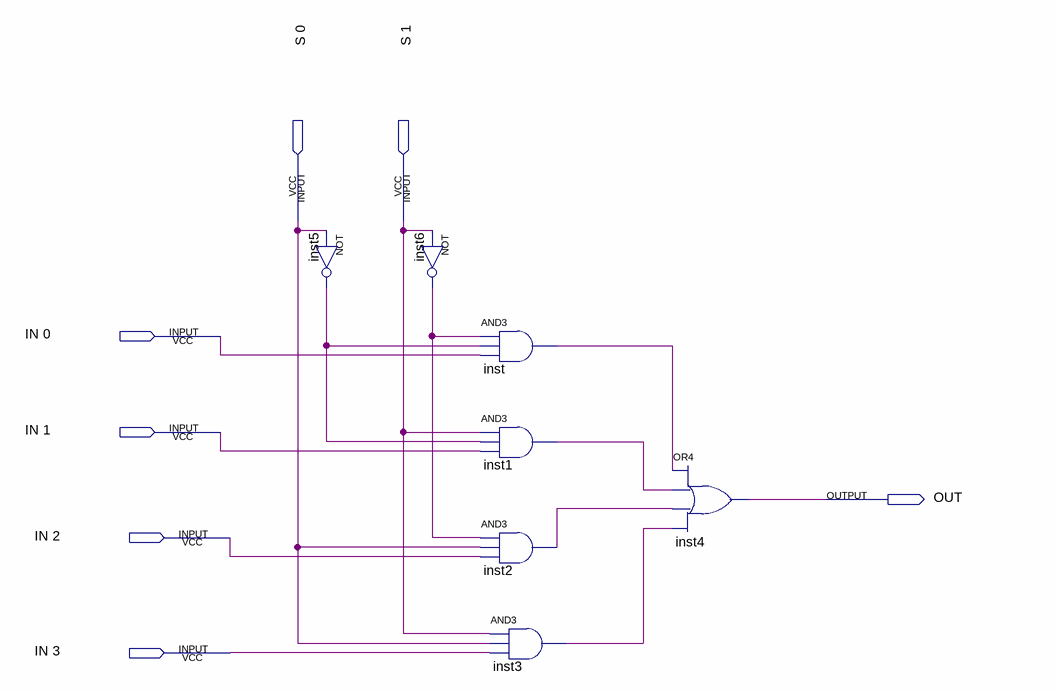
[diagram p0: schematic sheet]
// Quartus schematic 4_TO_1_MUX.bdf as structural Verilog: 7 symbols, 7 pins
module \4_TO_1_MUX  (
  input  \S_0 ,
  input  \S_1 ,
  input  \IN_0 ,
  input  \IN_1 ,
  input  \IN_2 ,
  input  \IN_3 ,
  output OUT
);

  wire inst1_out, inst2_out, inst3_out, inst5_out, inst6_out, inst_out;

  not inst5 (inst5_out, \S_0 );
  not inst6 (inst6_out, \S_1 );
  and inst (inst_out, inst6_out, inst5_out, \IN_0 );
  and inst1 (inst1_out, \S_1 , inst5_out, \IN_1 );
  and inst2 (inst2_out, inst6_out, \S_0 , \IN_2 );
  and inst3 (inst3_out, \S_1 , \S_0 , \IN_3 );
  or inst4 (OUT, inst_out, inst1_out, inst2_out, inst3_out);
endmodule
